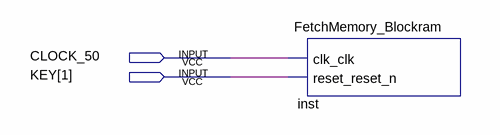
[diagram p0: schematic sheet]
// Quartus schematic Avalon_FetchMemory.bdf as structural Verilog: 1 symbols, 2 pins
module Avalon_FetchMemory (
  input  CLOCK_50,
  input  [1:1] KEY
);

  FetchMemory_Blockram inst (.clk_clk(CLOCK_50), .reset_reset_n(KEY[1]));
endmodule
